# Altium project caijiban.PrjPCB (part 2 of 2)

## Sheet P2IO.SchDoc
size A4
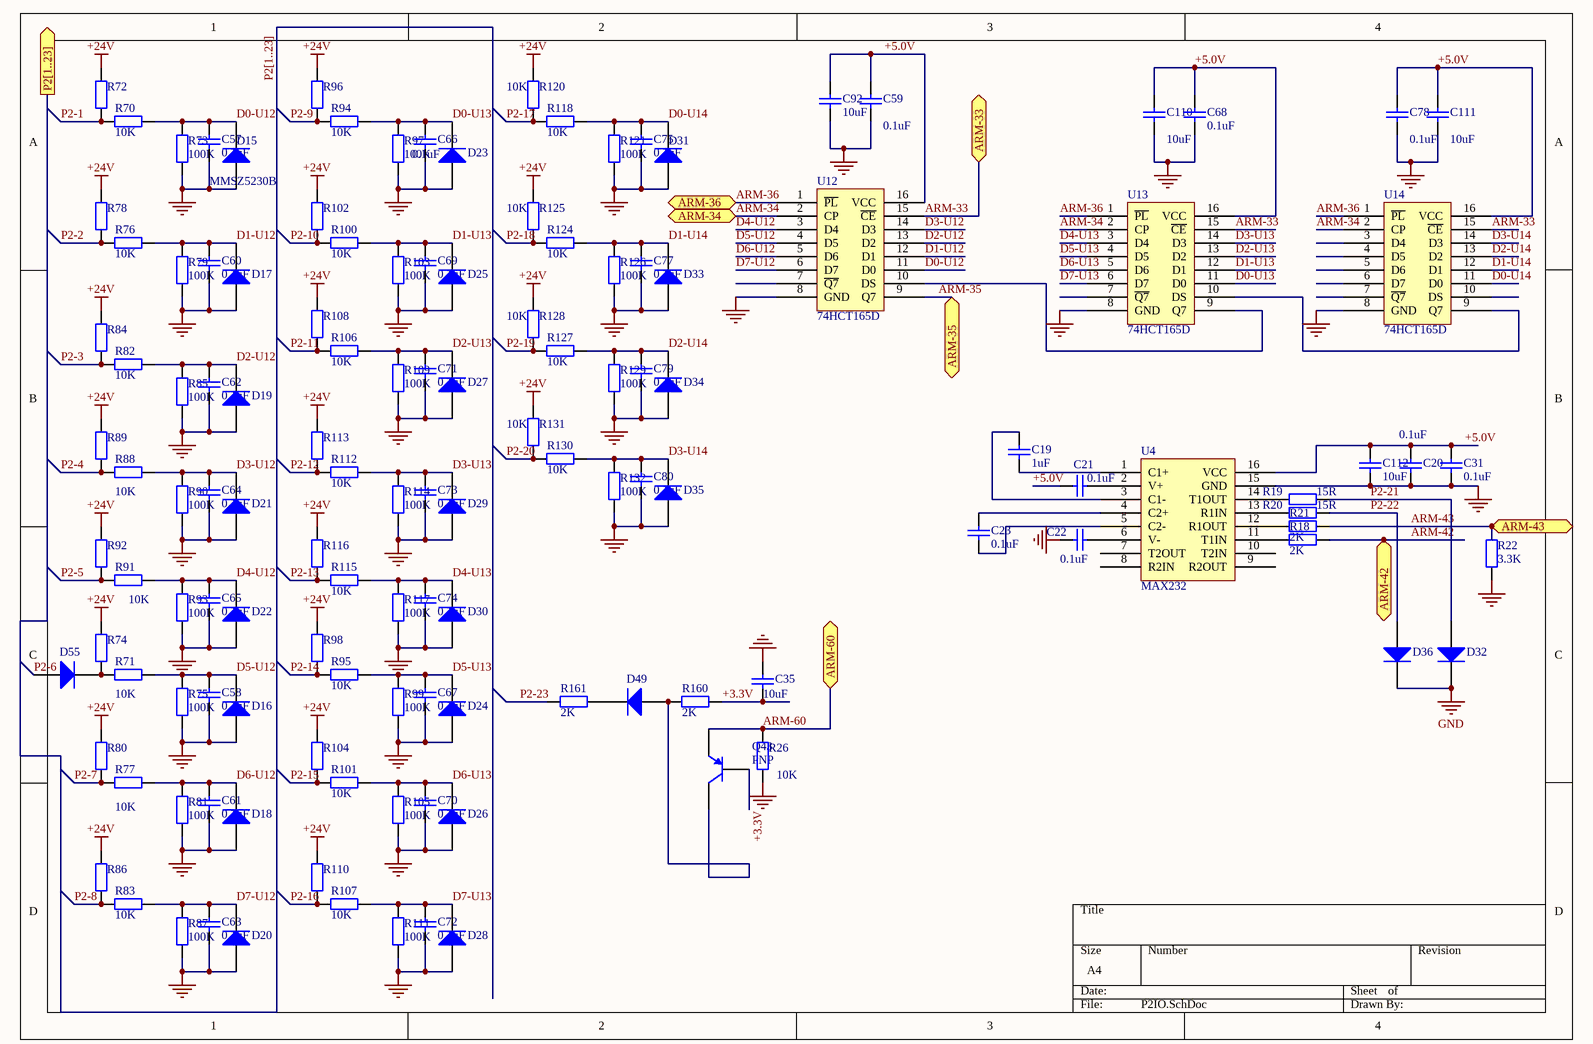
[diagram p11: P2IO.SchDoc]

### Parts
C19  value 1uF  [C0805]  (hidden comment: 1uF/10%)
C20  value 0.1uF  [C0805]  (hidden comment: Cap)
C21  value 0.1uF  [C0805]  (hidden comment: 104/10%)
C22  value 0.1uF  [C0805]  (hidden comment: 104/10%)
C23  value 0.1uF  [C0805]  (hidden comment: 104/10%)
C31  value 0.1uF  [C0805]  (hidden comment: Cap)
C35  value 10uF  [C1206]  (hidden comment: Cap)
C57  value 0.1uF  [C0805]  (hidden comment: 104/10%)
C58  value 0.1uF  [C0805]  (hidden comment: 104/10%)
C59  value 0.1uF  [C0805]  (hidden comment: Cap)
C60  value 0.1uF  [C0805]  (hidden comment: 104/10%)
C61  value 0.1uF  [C0805]  (hidden comment: 104/10%)
C62  value 0.1uF  [C0805]  (hidden comment: 104/10%)
C63  value 0.1uF  [C0805]  (hidden comment: 104/10%)
C64  value 0.1uF  [C0805]  (hidden comment: 104/10%)
C65  value 0.1uF  [C0805]  (hidden comment: 104/10%)
C66  value 0.1uF  [C0805]  (hidden comment: 104/10%)
C67  value 0.1uF  [C0805]  (hidden comment: 104/10%)
C68  value 0.1uF  [C0805]  (hidden comment: Cap)
C69  value 0.1uF  [C0805]  (hidden comment: 104/10%)
C70  value 0.1uF  [C0805]  (hidden comment: 104/10%)
C71  value 0.1uF  [C0805]  (hidden comment: 104/10%)
C72  value 0.1uF  [C0805]  (hidden comment: 104/10%)
C73  value 0.1uF  [C0805]  (hidden comment: 104/10%)
C74  value 0.1uF  [C0805]  (hidden comment: 104/10%)
C75  value 0.1uF  [C0805]  (hidden comment: 104/10%)
C77  value 0.1uF  [C0805]  (hidden comment: 104/10%)
C78  value 0.1uF  [C0805]  (hidden comment: Cap)
C79  value 0.1uF  [C0805]  (hidden comment: 104/10%)
C80  value 0.1uF  [C0805]  (hidden comment: 104/10%)
C92  value 10uF  [C1206]  (hidden comment: Cap)
C110  value 10uF  [C1206]  (hidden comment: Cap)
C111  value 10uF  [C1206]  (hidden comment: Cap)
C112  value 10uF  [C1206]  (hidden comment: Cap)
D15  MMSZ5230B  [SOD123]
D16  MMSZ5230B  [SOD123]  (value not drawn)
D17  MMSZ5230B  [SOD123]  (value not drawn)
D18  MMSZ5230B  [SOD123]  (value not drawn)
D19  MMSZ5230B  [SOD123]  (value not drawn)
D20  MMSZ5230B  [SOD123]  (value not drawn)
D21  MMSZ5230B  [SOD123]  (value not drawn)
D22  MMSZ5230B  [SOD123]  (value not drawn)
D23  MMSZ5230B  [SOD123]  (value not drawn)
D24  MMSZ5230B  [SOD123]  (value not drawn)
D25  MMSZ5230B  [SOD123]  (value not drawn)
D26  MMSZ5230B  [SOD123]  (value not drawn)
D27  MMSZ5230B  [SOD123]  (value not drawn)
D28  MMSZ5230B  [SOD123]  (value not drawn)
D29  MMSZ5230B  [SOD123]  (value not drawn)
D30  MMSZ5230B  [SOD123]  (value not drawn)
D31  MMSZ5230B  [SOD123]  (value not drawn)
D32  MMSZ5230B  [SOD123]  (value not drawn)
D33  MMSZ5230B  [SOD123]  (value not drawn)
D34  MMSZ5230B  [SOD123]  (value not drawn)
D35  MMSZ5230B  [SOD123]  (value not drawn)
D36  MMSZ5230B  [SOD123]  (value not drawn)
D49  1N4148W  [SOD123]  (value not drawn)
D55  1N4148W  [SOD123]  (value not drawn)
Q43  PNP  [Q43]
R18  value 2K  [R0805]  (hidden comment: Res2)
R19  value 15R  [R0805]  (hidden comment: 15R/1%)
R20  value 15R  [R0805]  (hidden comment: 15R/1%)
R21  value 2K  [R0805]  (hidden comment: Res2)
R22  value 3.3K  [R0805]  (hidden comment: Res2)
R26  value 10K  [R0805]  (hidden comment: Res2)
R70  value 10K  [R0805]  (hidden comment: 10K/1%)
R71  value 10K  [R0805]  (hidden comment: 10K/1%)
R72  NC  [R0805]  (value not drawn)
R73  value 100K  [R0805]  (hidden comment: 100K/1%)
R74  NC  [R0805]  (value not drawn)
R75  value 100K  [R0805]  (hidden comment: 100K/1%)
R76  value 10K  [R0805]  (hidden comment: 10K/1%)
R77  value 10K  [R0805]  (hidden comment: 10K/1%)
R78  NC  [R0805]  (value not drawn)
R79  value 100K  [R0805]  (hidden comment: 100K/1%)
R80  NC  [R0805]  (value not drawn)
R81  value 100K  [R0805]  (hidden comment: 100K/1%)
R82  value 10K  [R0805]  (hidden comment: 10K/1%)
R83  value 10K  [R0805]  (hidden comment: 10K/1%)
R84  NC  [R0805]  (value not drawn)
R85  value 100K  [R0805]  (hidden comment: 100K/1%)
R86  NC  [R0805]  (value not drawn)
R87  value 100K  [R0805]  (hidden comment: 100K/1%)
R88  value 10K  [R0805]  (hidden comment: 10K/1%)
R89  NC  [R0805]  (value not drawn)
R90  value 100K  [R0805]  (hidden comment: 100K/1%)
R91  value 10K  [R0805]  (hidden comment: 10K/1%)
R92  NC  [R0805]  (value not drawn)
R93  value 100K  [R0805]  (hidden comment: 100K/1%)
R94  value 10K  [R0805]  (hidden comment: 10K/1%)
R95  value 10K  [R0805]  (hidden comment: 10K/1%)
R96  10K/1%  [R0805]  (value not drawn)
R97  value 100K  [R0805]  (hidden comment: 100K/1%)
R98  10K/1%  [R0805]  (value not drawn)
R99  value 100K  [R0805]  (hidden comment: 100K/1%)
R100  value 10K  [R0805]  (hidden comment: 10K/1%)
R101  value 10K  [R0805]  (hidden comment: 10K/1%)
R102  10K/1%  [R0805]  (value not drawn)
R103  value 100K  [R0805]  (hidden comment: 100K/1%)
R104  10K/1%  [R0805]  (value not drawn)
R105  value 100K  [R0805]  (hidden comment: 100K/1%)
R106  value 10K  [R0805]  (hidden comment: 10K/1%)
R107  value 10K  [R0805]  (hidden comment: 10K/1%)
R108  10K/1%  [R0805]  (value not drawn)
R109  value 100K  [R0805]  (hidden comment: 100K/1%)
R110  10K/1%  [R0805]  (value not drawn)
R111  value 100K  [R0805]  (hidden comment: 100K/1%)
R112  value 10K  [R0805]  (hidden comment: 10K/1%)
R113  10K/1%  [R0805]  (value not drawn)
R114  value 100K  [R0805]  (hidden comment: 100K/1%)
R115  value 10K  [R0805]  (hidden comment: 10K/1%)
R116  10K/1%  [R0805]  (value not drawn)
R117  value 100K  [R0805]  (hidden comment: 100K/1%)
R118  value 10K  [R0805]  (hidden comment: 10K/1%)
R120  value 10K  [R0805]  (hidden comment: 10K/1%)
R121  value 100K  [R0805]  (hidden comment: 100K/1%)
R124  value 10K  [R0805]  (hidden comment: 10K/1%)
R125  value 10K  [R0805]  (hidden comment: 10K/1%)
R126  value 100K  [R0805]  (hidden comment: 100K/1%)
R127  value 10K  [R0805]  (hidden comment: 10K/1%)
R128  value 10K  [R0805]  (hidden comment: 10K/1%)
R129  value 100K  [R0805]  (hidden comment: 100K/1%)
R130  value 10K  [R0805]  (hidden comment: 10K/1%)
R131  value 10K  [R0805]  (hidden comment: 10K/1%)
R132  value 100K  [R0805]  (hidden comment: 100K/1%)
R160  value 2K  [R0805]  (hidden comment: Res2)
R161  value 2K  [R0805]  (hidden comment: Res2)
U4  MAX232  [SO-16]
U12  74HCT165D  [SO-16]
U13  74HCT165D  [SO-16]
U14  74HCT165D  [SO-16]

### Ports
ARM-33, ARM-34, ARM-35, ARM-36, ARM-42, ARM-43, ARM-60, P2[1..23]

### Nets
+3.3V: C35.1 Q43.2(B) R160.2
+5.0V: C20.1 C21.2 C31.2 C59.2 C68.1 C78.2 C92.2 C110.2 C111.2 C112.2 U4.16(VCC) U12.16(VCC) U13.16(VCC) U14.16(VCC)
+24V: R72.2 R74.2 R78.2 R80.1 R84.2 R86.2 R89.1 R92.1 R96.2 R98.2 R102.2 R104.2 R108.2 R110.2 R113.2 R116.2 R120.2 R125.2 R128.2 R131.2
GND: C20.2 C22.2 C31.1 C35.2 C57.2 C58.1 C59.1 C60.2 C61.2 C62.2 C63.2 C64.1 C65.2 C66.2 C67.2 C68.2 C69.2 C70.2 C71.2 C72.2 C73.2 C74.2 C75.2 C77.2 C78.1 C79.2 C80.2 C92.1 C110.1 C111.1 C112.1 D15.1(A) D16.1(A) D17.1(A) D18.1(A) D19.1(A) D20.1(A) D21.1(A) D22.1(A) D23.1(A) D24.1(A) D25.1(A) D26.1(A) D27.1(A) D28.1(A) D29.1(A) D30.1(A) D31.1(A) D32.2(K) D33.1(A) D34.1(A) D35.1(A) D36.2(K) R22.1 R26.2 R73.1 R75.2 R79.1 R81.2 R85.1 R87.1 R90.2 R93.2 R97.1 R99.1 R103.1 R105.1 R109.1 R111.1 R114.1 R117.1 R121.1 R126.1 R129.1 R132.1 U4.15(GND) U12.8(GND) U13.8(GND) U14.8(GND)
ARM-33: U12.15(~{CE}) U13.15(~{CE}) U14.15(~{CE}) ; port ARM-33
ARM-34: U12.2(CP) U13.2(CP) U14.2(CP) ; port ARM-34
ARM-35: U12.9(Q7) ; port ARM-35
ARM-36: U12.1(~{PL}) U13.1(~{PL}) U14.1(~{PL}) ; port ARM-36
ARM-42: R18.2 ; port ARM-42
ARM-43: R21.2 R22.2 ; port ARM-43
ARM-60: Q43.3(E) R26.1 ; port ARM-60
D0-U12: C57.1 D15.2(K) R70.2 R73.2 U12.11(D0)
D0-U13: C66.1 D23.2(K) R94.2 R97.2 U13.11(D0)
D0-U14: C75.1 D31.2(K) R118.2 R121.2 U14.11(D0)
D1-U12: C60.1 D17.2(K) R76.2 R79.2 U12.12(D1)
D1-U13: C69.1 D25.2(K) R100.2 R103.2 U13.12(D1)
D1-U14: C77.1 D33.2(K) R124.2 R126.2 U14.12(D1)
D2-U12: C62.1 D19.2(K) R82.2 R85.2 U12.13(D2)
D2-U13: C71.1 D27.2(K) R106.2 R109.2 U13.13(D2)
D2-U14: C79.1 D34.2(K) R127.2 R129.2 U14.13(D2)
D3-U12: C64.2 D21.2(K) R88.1 R90.1 U12.14(D3)
D3-U13: C73.1 D29.2(K) R112.2 R114.2 U13.14(D3)
D3-U14: C80.1 D35.2(K) R130.2 R132.2 U14.14(D3)
D4-U12: C65.1 D22.2(K) R91.1 R93.1 U12.3(D4)
D4-U13: C74.1 D30.2(K) R115.2 R117.2 U13.3(D4)
D5-U12: C58.2 D16.2(K) R71.1 R75.1 U12.4(D5)
D5-U13: C67.1 D24.2(K) R95.2 R99.2 U13.4(D5)
D6-U12: C61.1 D18.2(K) R77.1 R81.1 U12.5(D6)
D6-U13: C70.1 D26.2(K) R101.2 R105.2 U13.5(D6)
D7-U12: C63.1 D20.2(K) R83.2 R87.2 U12.6(D7)
D7-U13: C72.1 D28.2(K) R107.2 R111.2 U13.6(D7)
P2-1: R70.1 R72.1
P2-2: R76.1 R78.1
P2-3: R82.1 R84.1
P2-4: R88.2 R89.2
P2-5: R91.2 R92.2
P2-6: D55.1(A)
P2-7: R77.2 R80.2
P2-8: R83.1 R86.1
P2-9: R94.1 R96.1
P2-10: R100.1 R102.1
P2-11: R106.1 R108.1
P2-12: R112.1 R113.1
P2-13: R115.1 R116.1
P2-14: R95.1 R98.1
P2-15: R101.1 R104.1
P2-16: R107.1 R110.1
P2-17: R118.1 R120.1
P2-18: R124.1 R125.1
P2-19: R127.1 R128.1
P2-20: R130.1 R131.1
P2-21: D32.1(A) R19.1
P2-22: D36.1(A) R20.1
P2-23: R161.1
NetC19_1: C19.1 U4.3(C1-)
NetC19_2: C19.2 U4.1(C1+)
NetC21_1: C21.1 U4.2(V+)
NetC22_1: C22.1 U4.6(V-)
NetC23_1: C23.1 U4.4(C2+)
NetC23_2: C23.2 U4.5(C2-)
NetD49_1: D49.1(A) Q43.1(C) R160.1
NetD49_2: D49.2(K) R161.2
NetD55_2: D55.2(K) R71.2 R74.1
NetR18_1: R18.1 U4.11(T1IN)
NetR19_2: R19.2 U4.14(T1OUT)
NetR20_2: R20.2 U4.13(R1IN)
NetR21_1: R21.1 U4.12(R1OUT)
NetU12_10: U12.10(DS) U13.9(Q7)
NetU13_10: U13.10(DS) U14.9(Q7)

Not connected (* = marked no-connect by the designer): U4 7(T2OUT) 8(R2IN) 9(R2OUT) 10(T2IN); U12 7(~{Q7}); U13 7(~{Q7}); U14 3(D4) 4(D5) 5(D6) 6(D7) 7(~{Q7}) 10(DS)

### Buses and harness runs
bus P2[1..23] = port P2[1..23]

### Library data of the parts
C19-C23 C31 C35 C57 C59-C75 C77-C80 C92 C110-C112 = Cap: Capacitor; Published: 8-Jun-2000; LatestRevisionDate: 17-Jul-2002; LatestRevisionNote: Re-released for DXP Platform.; PackageReference: RAD-0.3; Publisher: Altium Limited
C58 = Cap: Capacitor; pin to pad: 1>2 2>1; Published: 8-Jun-2000; LatestRevisionDate: 17-Jul-2002; LatestRevisionNote: Re-released for DXP Platform.; PackageReference: RAD-0.3; Publisher: Altium Limited
D15-D36 D49 D55 = Diode 1N4007: 1 Amp General Purpose Rectifier; Published: 8-Jun-2000; LatestRevisionDate: 17-Jul-2002; LatestRevisionNote: Re-released for DXP Platform.; DatasheetDocument: 1998; PackageDocument: Aug-1999; PackageReference: DO-41; Publisher: Altium Limited; Code_JEDEC: DO-204-AL; ComponentLink1Description: Manufacturer Link; ComponentLink1URL: http://www.fairchildsemi.com/; ComponentLink2Description: Datasheet; ComponentLink2URL: http://www.fairchildsemi.com/ds/1N%2F1N4001.pdf
Q43 = PNP: PNP Bipolar Transistor; Published: 8-Jun-2000; LatestRevisionDate: 17-Jul-2002; LatestRevisionNote: Re-released for DXP Platform.; PackageReference: SOT-23B; Publisher: Altium Limited; Code_JEDEC: SOT-23
R18-R22 R26 R70-R95 R97 R99-R101 R103 R105-R107 R109 R111 R112 R114 R115 R117 R118 R120 R121 R124-R132 R160 R161 = Res2: Resistor; Published: 8-Jun-2000; LatestRevisionDate: 17-Jul-2002; LatestRevisionNote: Re-released for DXP Platform.; PackageReference: AXIAL-0.4; Publisher: Altium Limited
  R72 R74 R78 R80 R84 R86 R89 R92: Value: NC
R96 R98 R102 R104 R108 R110 R113 R116 = Res2: Resistor; Value: NC; Published: 8-Jun-2000; LatestRevisionDate: 17-Jul-2002; LatestRevisionNote: Re-released for DXP Platform.; PackageReference: AXIAL-0.4; Publisher: Altium Limited
U4 U12-U14 = Component_1

## Sheet 26P2.SchDoc
size A4
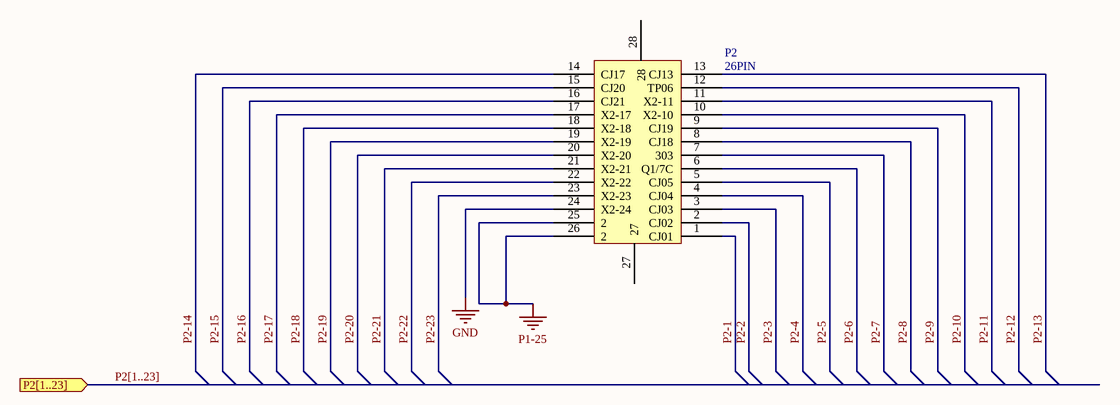
[diagram p12: 26P2.SchDoc]

### Parts
P2  26PIN  [2*13]

### Ports
P2[1..23]

### Nets
GND: P2.24(X2-24)
P1-25: P2.25(2) P2.26(2)
P2-1: P2.1(CJ01)
P2-2: P2.2(CJ02)
P2-3: P2.3(CJ03)
P2-4: P2.4(CJ04)
P2-5: P2.5(CJ05)
P2-6: P2.6(Q1/7C)
P2-7: P2.7(303)
P2-8: P2.8(CJ18)
P2-9: P2.9(CJ19)
P2-10: P2.10(X2-10)
P2-11: P2.11(X2-11)
P2-12: P2.12(TP06)
P2-13: P2.13(CJ13)
P2-14: P2.14(CJ17)
P2-15: P2.15(CJ20)
P2-16: P2.16(CJ21)
P2-17: P2.17(X2-17)
P2-18: P2.18(X2-18)
P2-19: P2.19(X2-19)
P2-20: P2.20(X2-20)
P2-21: P2.21(X2-21)
P2-22: P2.22(X2-22)
P2-23: P2.23(X2-23)

Not connected (* = marked no-connect by the designer): P2 27 28

### Buses and harness runs
bus P2[1..23] = port P2[1..23]

### Library data of the parts
P2 = Component_1

## Nets that join several sheets
+2.5V: 四通道输出运算放大（2） (R166.1), 输出运算放大(3) (9 pins)
+3.3V: Power (8 pins), STM32 (24 pins), 智能四通道高端开关（1） (R140.1 R141.1), 四通道输出运算放大（2） (D3.2), 输出运算放大(3) (6 pins), 集成隔离器（4） (7 pins), 输出放大（6） (8 pins), P2IO (C35.1 Q43.2 R160.2)
+5.0V: Power (15 pins), STM32 (9 pins), 输出运算放大(3) (C96.1 L2.1), 集成隔离器（4） (6 pins), 输出运算放大器（5） (6 pins), 输出放大（6） (12 pins), P2IO (14 pins)
+24V: Power (9 pins), 智能四通道高端开关（1） (8 pins), 输出放大（6） (R58.2 R66.1 R147.2 R155.1), P2IO (20 pins)
AGND: 四通道输出运算放大（2） (C115.1), 输出运算放大(3) (36 pins)
GND: Power (38 pins), STM32 (33 pins), 智能四通道高端开关（1） (6 pins), 输出运算放大(3) (C96.2 L3.1), 集成隔离器（4） (14 pins), 输出运算放大器（5） (17 pins), 输出放大（6） (36 pins), P2IO (79 pins), 26P2 (P2.24)
P1-21: Power (9 pins), 28P1 (P1.21), 四通道输出运算放大（2） (C122.2 U8.4)
P1-22: Power (9 pins), 28P1 (P1.22), 四通道输出运算放大（2） (C153.1 U8.11)
P1-25: Power (D48.2 L6.1), 28P1 (P1.2 P1.25), 智能四通道高端开关（1） (D57.1 D58.1 D59.1 D60.1), 26P2 (P2.25 P2.26)
P1-26: Power (10 pins), 28P1 (P1.26), 四通道输出运算放大（2） (9 pins), 输出运算放大(3) (R135.2)
P1-27: Power (D41.1), 28P1 (P1.1 P1.27)
ARM-8: STM32 (U5.8), 四通道输出运算放大（2） (A0.1 C115.2 R184.2)
ARM-9: STM32 (U5.9), 输出运算放大(3) (A1.1 C116.1 D6.1 R38.2)
ARM-10: STM32 (U5.10), 输出运算放大(3) (A2.1 C131.1 D8.1 R44.2)
ARM-11: STM32 (U5.11), 输出运算放大(3) (A3.1 C132.2 D10.1 R50.1)
ARM-14: STM32 (U5.14), 输出放大（6） (R60.1)
ARM-15: STM32 (U5.15), 输出放大（6） (R68.1)
ARM-16: STM32 (U5.16), 输出放大（6） (R149.1)
ARM-17: STM32 (U5.17), 输出放大（6） (R157.2)
ARM-20: STM32 (U5.20), 输出运算放大器（5） (DA1.1 U25.5)
ARM-21: STM32 (U5.21), 输出运算放大器（5） (DA2.1 U25.12)
ARM-23: STM32 (U5.23), 输出运算放大(3) (C222.1 D107.1 R225.2)
ARM-24: STM32 (U5.24), 输出运算放大(3) (A4.1 C130.2 D52.1 R170.2)
ARM-25: STM32 (U5.25), 输出运算放大器（5） (C76.2 R214.1)
ARM-26: STM32 (U5.22 U5.26), 输出运算放大器（5） (C81.2 R217.1)
ARM-29: STM32 (U5.29), 集成隔离器（4） (R14.1)
ARM-30: STM32 (U5.30), 集成隔离器（4） (R11.1)
ARM-33: STM32 (U5.33), P2IO (U12.15 U13.15 U14.15)
ARM-34: STM32 (U5.34), P2IO (U12.2 U13.2 U14.2)
ARM-35: STM32 (U5.35), P2IO (U12.9)
ARM-36: STM32 (U5.36), P2IO (U12.1 U13.1 U14.1)
ARM-37: STM32 (U5.37), 智能四通道高端开关（1） (R136.2 R171.2)
ARM-38: STM32 (U5.38), 智能四通道高端开关（1） (R137.2 R172.2)
ARM-39: STM32 (U5.39), 智能四通道高端开关（1） (R138.2 R173.2)
ARM-40: STM32 (U5.40), 智能四通道高端开关（1） (R139.2 R174.2)
ARM-42: STM32 (U5.42), P2IO (R18.2)
ARM-43: STM32 (U5.43), P2IO (R21.2 R22.2)
ARM-44: STM32 (U5.44), 集成隔离器（4） (R6.2 TP2.1 U1.6)
ARM-45: STM32 (U5.45), 集成隔离器（4） (R7.2 TP1.1 U1.5)
ARM-51: STM32 (U5.51), 智能四通道高端开关（1） (R140.2 U15.4)
ARM-52: STM32 (U5.52), 智能四通道高端开关（1） (R141.2 U15.8)
ARM-60: STM32 (U5.60), P2IO (Q43.3 R26.1)
ARM-62: STM32 (U5.62), 集成隔离器（4） (R17.1 U3.5 U3.6)
P1-3: 28P1 (P1.3), 智能四通道高端开关（1） (D57.2 U15.18)
P1-4: 28P1 (P1.4), 智能四通道高端开关（1） (D58.2 U15.17)
P1-5: 28P1 (P1.5), 智能四通道高端开关（1） (D59.2 U15.14)
P1-6: 28P1 (P1.6), 智能四通道高端开关（1） (D60.2 U15.13)
P1-7: 28P1 (P1.7), 四通道输出运算放大（2） (R34.1)
P1-8: 28P1 (P1.8), 输出运算放大(3) (D5.2)
P1-9: 28P1 (P1.9), 输出运算放大(3) (D7.2 R201.2)
P1-10: 28P1 (P1.10), 输出运算放大(3) (D9.2 R202.2)
P1-11: 28P1 (P1.11), 输出运算放大(3) (R169.1)
P1-12: 28P1 (P1.12), 输出运算放大(3) (R221.1 R222.2)
P1-13: 28P1 (P1.13), 集成隔离器（4） (TR2.3)
P1-14: 28P1 (P1.14), 集成隔离器（4） (TR2.4)
P1-15: 28P1 (P1.15), 集成隔离器（4） (R5.2 TR1.3)
P1-16: 28P1 (P1.16), 集成隔离器（4） (R5.1 TR1.4)
P1-17: 28P1 (P1.17), 输出运算放大器（5） (D101.2 R204.1 R205.1 R212.1)
P1-18: 28P1 (P1.18), 输出运算放大器（5） (5 pins)
P1-19: 28P1 (P1.19), 输出放大（6） (D11.1 R58.1)
P1-20: 28P1 (P1.20), 输出放大（6） (D13.1 R66.2)
P1-23: 28P1 (P1.23), 输出放大（6） (D42.1 R147.1)
P1-24: 28P1 (P1.24), 输出放大（6） (D44.1 R155.2)
P2-1: P2IO (R70.1 R72.1), 26P2 (P2.1)
P2-2: P2IO (R76.1 R78.1), 26P2 (P2.2)
P2-3: P2IO (R82.1 R84.1), 26P2 (P2.3)
P2-4: P2IO (R88.2 R89.2), 26P2 (P2.4)
P2-5: P2IO (R91.2 R92.2), 26P2 (P2.5)
P2-6: P2IO (D55.1), 26P2 (P2.6)
P2-7: P2IO (R77.2 R80.2), 26P2 (P2.7)
P2-8: P2IO (R83.1 R86.1), 26P2 (P2.8)
P2-9: P2IO (R94.1 R96.1), 26P2 (P2.9)
P2-10: P2IO (R100.1 R102.1), 26P2 (P2.10)
P2-11: P2IO (R106.1 R108.1), 26P2 (P2.11)
P2-12: P2IO (R112.1 R113.1), 26P2 (P2.12)
P2-13: P2IO (R115.1 R116.1), 26P2 (P2.13)
P2-14: P2IO (R95.1 R98.1), 26P2 (P2.14)
P2-15: P2IO (R101.1 R104.1), 26P2 (P2.15)
P2-16: P2IO (R107.1 R110.1), 26P2 (P2.16)
P2-17: P2IO (R118.1 R120.1), 26P2 (P2.17)
P2-18: P2IO (R124.1 R125.1), 26P2 (P2.18)
P2-19: P2IO (R127.1 R128.1), 26P2 (P2.19)
P2-20: P2IO (R130.1 R131.1), 26P2 (P2.20)
P2-21: P2IO (D32.1 R19.1), 26P2 (P2.21)
P2-22: P2IO (D36.1 R20.1), 26P2 (P2.22)
P2-23: P2IO (R161.1), 26P2 (P2.23)